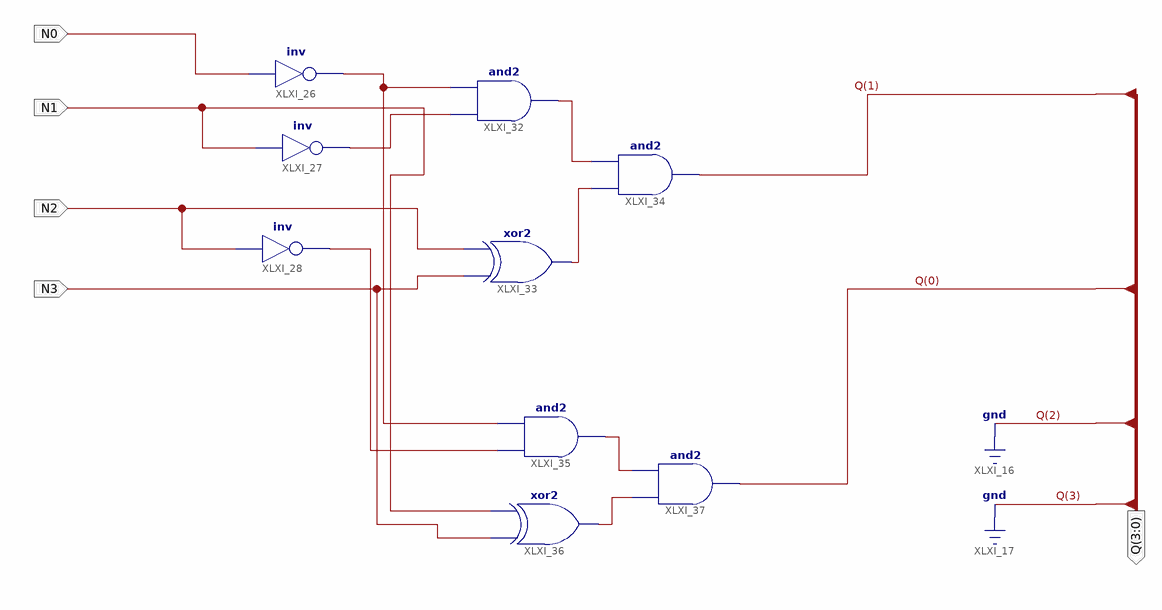
[diagram p0: schematic sheet 1]
// Xilinx ISE schematic NUM_XX.sch (spartan6) as structural Verilog: 9 symbols, 5 ports
module NUM_XX (
  input  N2,
  input  N3,
  input  N0,
  input  N1,
  output [3:0] Q
);

  wire XLXN_81, XLXN_82, XLXN_83, XLXN_84, XLXN_86, XLXN_88, XLXN_89;

  not XLXI_27 (XLXN_82, N1);
  not XLXI_28 (XLXN_86, N2);
  not XLXI_26 (XLXN_81, N0);
  and XLXI_32 (XLXN_83, XLXN_82, XLXN_81);
  xor XLXI_33 (XLXN_84, N3, N2);
  and XLXI_34 (Q[1], XLXN_84, XLXN_83);
  and XLXI_35 (XLXN_88, XLXN_86, XLXN_81);
  xor XLXI_36 (XLXN_89, N3, N1);
  and XLXI_37 (Q[0], XLXN_89, XLXN_88);

  assign Q[3:2] = 2'b00;
endmodule
